# EAGLE schematic neuron_v3 (EAGLE 9.6.2)
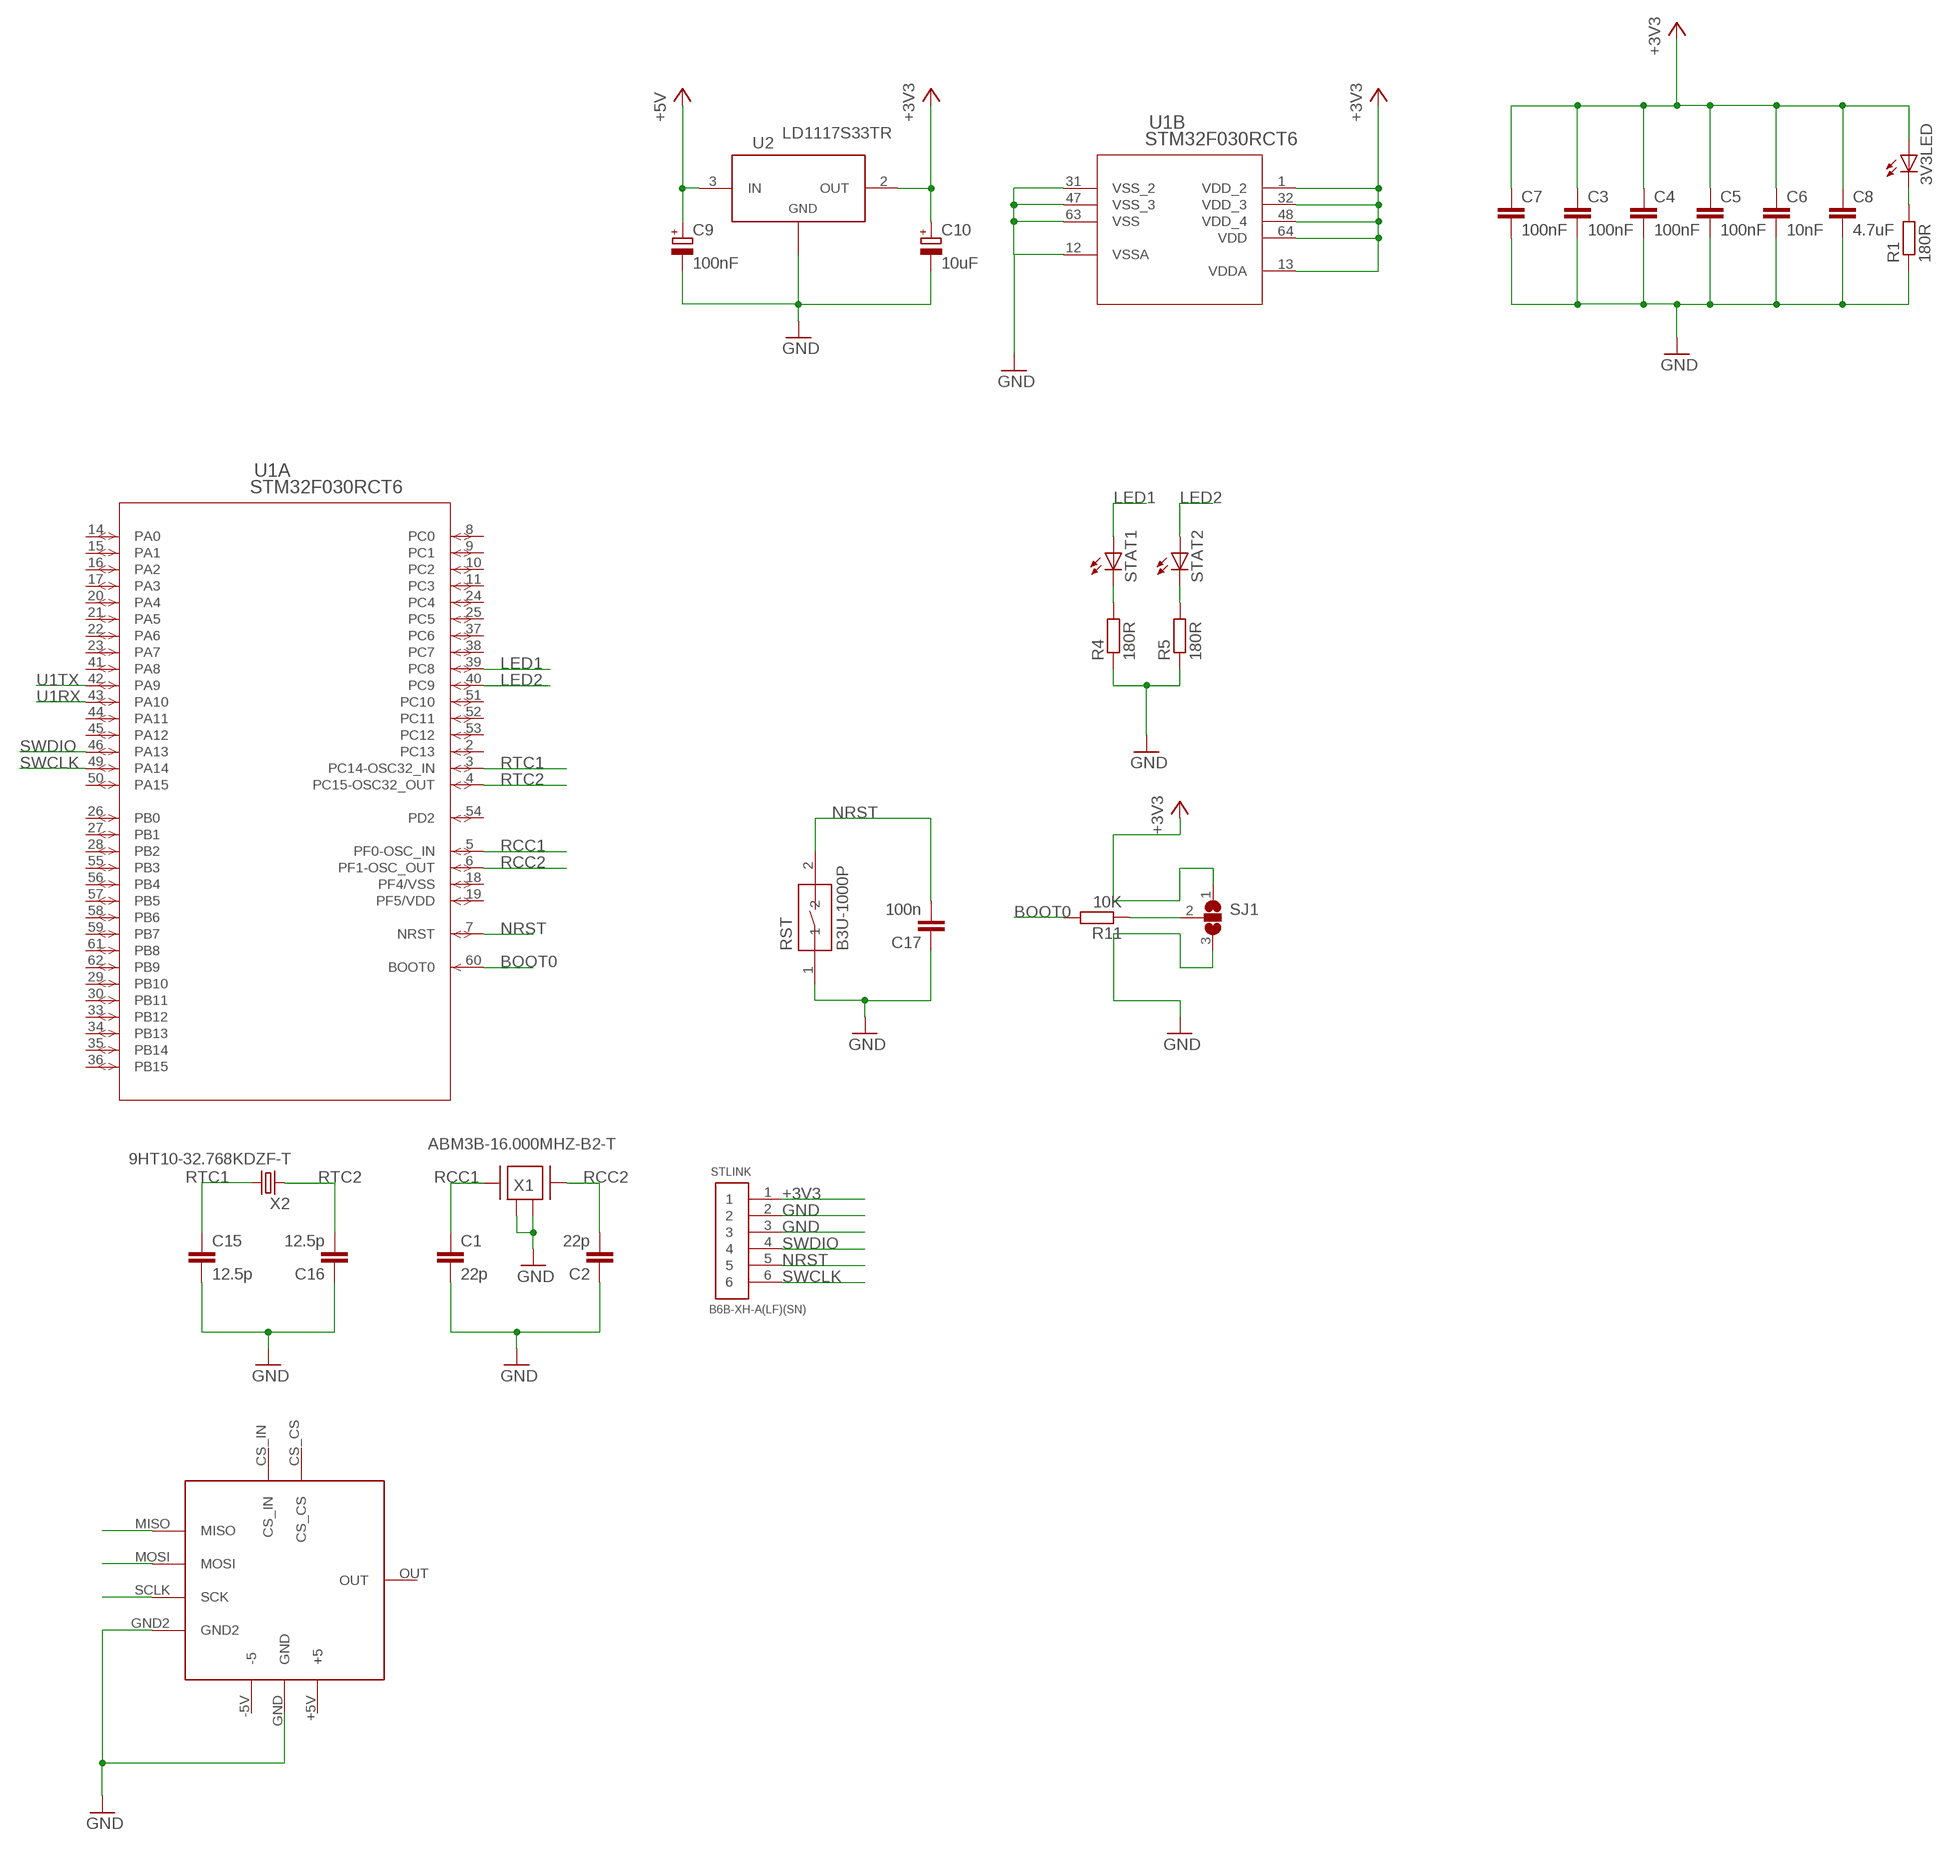
[diagram p0: schematic, sheet 1]

## Parts
3V3LED  LEDCHIPLED_0805  [CHIPLED_0805]
C1  22p  C-EUC0603K  [C0603K]
C2  22p  C-EUC0603K  [C0603K]
C3  100nF  C-EUC0603K  [C0603K]
C4  100nF  C-EUC0603K  [C0603K]
C5  100nF  C-EUC0603K  [C0603K]
C6  10nF  C-EUC0603K  [C0603K]
C7  100nF  C-EUC0603K  [C0603K]
C8  4.7uF  C-EUC0603K  [C0603K]
C9  100nF  CPOL-EUA/3216-18W  [A/3216-18W]
C10  10uF  CPOL-EUA/3216-18W  [A/3216-18W]
C15  12.5p  C-EUC0603K  [C0603K]
C16  12.5p  C-EUC0603K  [C0603K]
C17  100n  C-EUC0603K  [C0603K]
R1  180R  R-EU_R0603  [R0603]
R4  180R  R-EU_R0603  [R0603]
R5  180R  R-EU_R0603  [R0603]
R11  10K  R-EU_R0603  [R0603]
RST  B3U-1000P  [B3U-1000P]
SJ1  SJ2W  [SJ_2]
STAT1  LEDCHIPLED_0805  [CHIPLED_0805]
STAT2  LEDCHIPLED_0805  [CHIPLED_0805]
STLINK  B6B-XH-A(LF)(SN)  [B6B-XH-A(LF)(SN)]
U1  STM32F030RCT6  [LQFP64-10X10MM]
U2  LD1117S33TR  [SOT-223]
U$1  NEURON_BOARD  [NEURON_BOARD]
X1  ABM3B-16.000MHZ-B2-T  [ABM3B-16.000MHZ-B2-T]
X2  9HT10-32.768KDZF-T  [9HT10-32.768KDZF-T]

## Nets
+3V3: 3V3LED.A C3.1 C4.1 C5.1 C6.1 C7.1 C8.1 C10.+ SJ1.1 STLINK.1 U1.1(B:VDD_2) U1.13(B:VDDA) U1.32(B:VDD_3) U1.48(B:VDD_4) U1.64(B:VDD) U2.2(OUT) U2.4
+5V: C9.+ U2.3(IN)
BOOT0: R11.2 U1.60(A:BOOT0)
GND: C1.2 C2.1 C3.2 C4.2 C5.2 C6.2 C7.2 C8.2 C9.- C10.- C15.2 C16.1 C17.1 R1.1 R4.1 R5.1 RST.1 SJ1.3 STLINK.2 STLINK.3 U1.12(B:VSSA) U1.31(B:VSS_2) U1.47(B:VSS_3) U1.63(B:VSS) U2.1(ADJ/GND) U$1.GND U$1.GND2 X1.2 X1.4
LED1: STAT1.A U1.39(A:PC8)
LED2: STAT2.A U1.40(A:PC9)
N$1: U$1.SCLK(SCK)
N$2: U$1.MOSI
N$3: U$1.MISO
N$4: 3V3LED.C R1.2
N$6: R4.2 STAT1.C
N$7: R5.2 STAT2.C
N$14: R11.1 SJ1.2
NRST: C17.2 RST.2 STLINK.5 U1.7(A:NRST)
RCC1: C1.1 U1.5(A:PF0-OSC_IN) X1.1
RCC2: C2.2 U1.6(A:PF1-OSC_OUT) X1.3
RTC1: C15.1 U1.3(A:PC14-OSC32_IN) X2.2
RTC2: C16.2 U1.4(A:PC15-OSC32_OUT) X2.1
SWCLK: STLINK.6 U1.49(A:PA14)
SWDIO: STLINK.4 U1.46(A:PA13)
U1RX: U1.43(A:PA10)
U1TX: U1.42(A:PA9)
Unconnected: U1.2(A:PC13) U1.8(A:PC0) U1.9(A:PC1) U1.10(A:PC2) U1.11(A:PC3) U1.14(A:PA0) U1.15(A:PA1) U1.16(A:PA2) U1.17(A:PA3) U1.18(A:PF4/VSS) U1.19(A:PF5/VDD) U1.20(A:PA4) U1.21(A:PA5) U1.22(A:PA6) U1.23(A:PA7) U1.24(A:PC4) U1.25(A:PC5) U1.26(A:PB0) U1.27(A:PB1) U1.28(A:PB2) U1.29(A:PB10) U1.30(A:PB11) U1.33(A:PB12) U1.34(A:PB13) U1.35(A:PB14) U1.36(A:PB15) U1.37(A:PC6) U1.38(A:PC7) U1.41(A:PA8) U1.44(A:PA11) U1.45(A:PA12) U1.50(A:PA15) U1.51(A:PC10) U1.52(A:PC11) U1.53(A:PC12) U1.54(A:PD2) U1.55(A:PB3) U1.56(A:PB4) U1.57(A:PB5) U1.58(A:PB6) U1.59(A:PB7) U1.61(A:PB8) U1.62(A:PB9) U$1.+5V(+5) U$1.-5V(-5) U$1.CS_CS U$1.CS_IN U$1.OUT

## Library data of the parts
3V3LED STAT1 STAT2 = audio amplifier example:LED
C1-C8 C15-C17 = rcl:C-EU: CAPACITOR, European symbol; SPICEPREFIX: C
C9 C10 = rcl:CPOL-EU: POLARIZED CAPACITOR, European symbol; SPICEPREFIX: C
R1 R4 R5 R11 = rcl:R-EU_: RESISTOR, European symbol; SPICEPREFIX: R
RST = Switch:B3U-1000P: SWITCH TACTILE SPST-NO 0.05A 12V Manufacturer's datasheet <https://omronfs.omron.com/en_US/ecb/products/pdf/en-b3u.pdf>; CREATED_BY: PCBLayout.com; DIGI_KEY_PART_NUMBER: SW1020CT-ND; MANUFACTURER: Omron Electronics Inc-EMC Div; MPN: B3U-1000P; PACKAGE: SPST-NO
SJ1 = jumper:SJ2W: SMD solder JUMPER
STLINK = Headers:B6B-XH-A(LF)(SN): CONN HEADER VERT 6POS 2.5MM Manufacturer's datasheet <http://www.jst-mfg.com/product/pdf/eng/eXH.pdf>; CREATED_BY: PCBLayout.com; DIGIKEY_PARTNO: 455-2271-ND; MANUFACTURER: JST Sales America Inc.; MPN: B6B-XH-A(LF)(SN)
U1 = titled:STM32F030RCT6; BUILT_BY: EMA_UL_Team; COPYRIGHT: Copyright (C) 2018 Accelerated Designs. All rights reserved; MANUFACTURER_PART_NUMBER: STM32F030RCT6; SOURCELIBRARY: Updates_to_database_2020-10-19; VENDOR: STMicroelectronics
U2 = IC:LD1117S33TR: IC REG LINEAR 3.3V 800MA SOT223 Manufacturer's datasheet <http://www.st.com/content/ccc/resource/technical/document/datasheet/99/3b/7d/91/91/51/4b/be/CD00000544.pdf/files/CD00000544.pdf/jcr:content/translations/en.CD00000544.pdf>; CREATED_BY: PCBLayout.com; DIGIKEY_PART_NUMBER: 497-1242-2-ND; MANUFACTURER: STMicroelectronics; MPN: LD1117S33TR; PACKAGE: SOT-223
U$1 = titled:NEURON_BOARD
X1 = Crystals_Oscillators:ABM3B-16.000MHZ-B2-T: CRYSTAL 16.0000MHZ 18PF SMD Manufacturer's datasheet <https://abracon.com/Resonators/abm3b.pdf>; CREATED_BY: PCBLayout.com; DIGIKEY_PART_NUMBER: 535-9122-2-ND; MANUFACTURER: Abracon LLC; MPN: ABM3B-16.000MHZ-B2-T; PACKAGE: SMD 4
X2 = Crystals:9HT10-32.768KDZF-T: CRYSTAL 32.7680KHZ 12.5PF SMD Manufacturer's datasheet <http://www.txccrystal.com/images/pdf/9ht10.pdf>; CREATED_BY: PCBLayout.com; DIGIKEY_PART_NUMBER: 887-1504-2-ND; MANUFACTURER: TXC CORPORATION; MPN: 9HT10-32.768KDZF-T; PACKAGE: SMD

## Net classes
0 default: width 0.152 mm, drill 0.152 mm, clearance 0.152 mm